# EasyEDA schematic SCH_RK86_power_2024-10-30.json
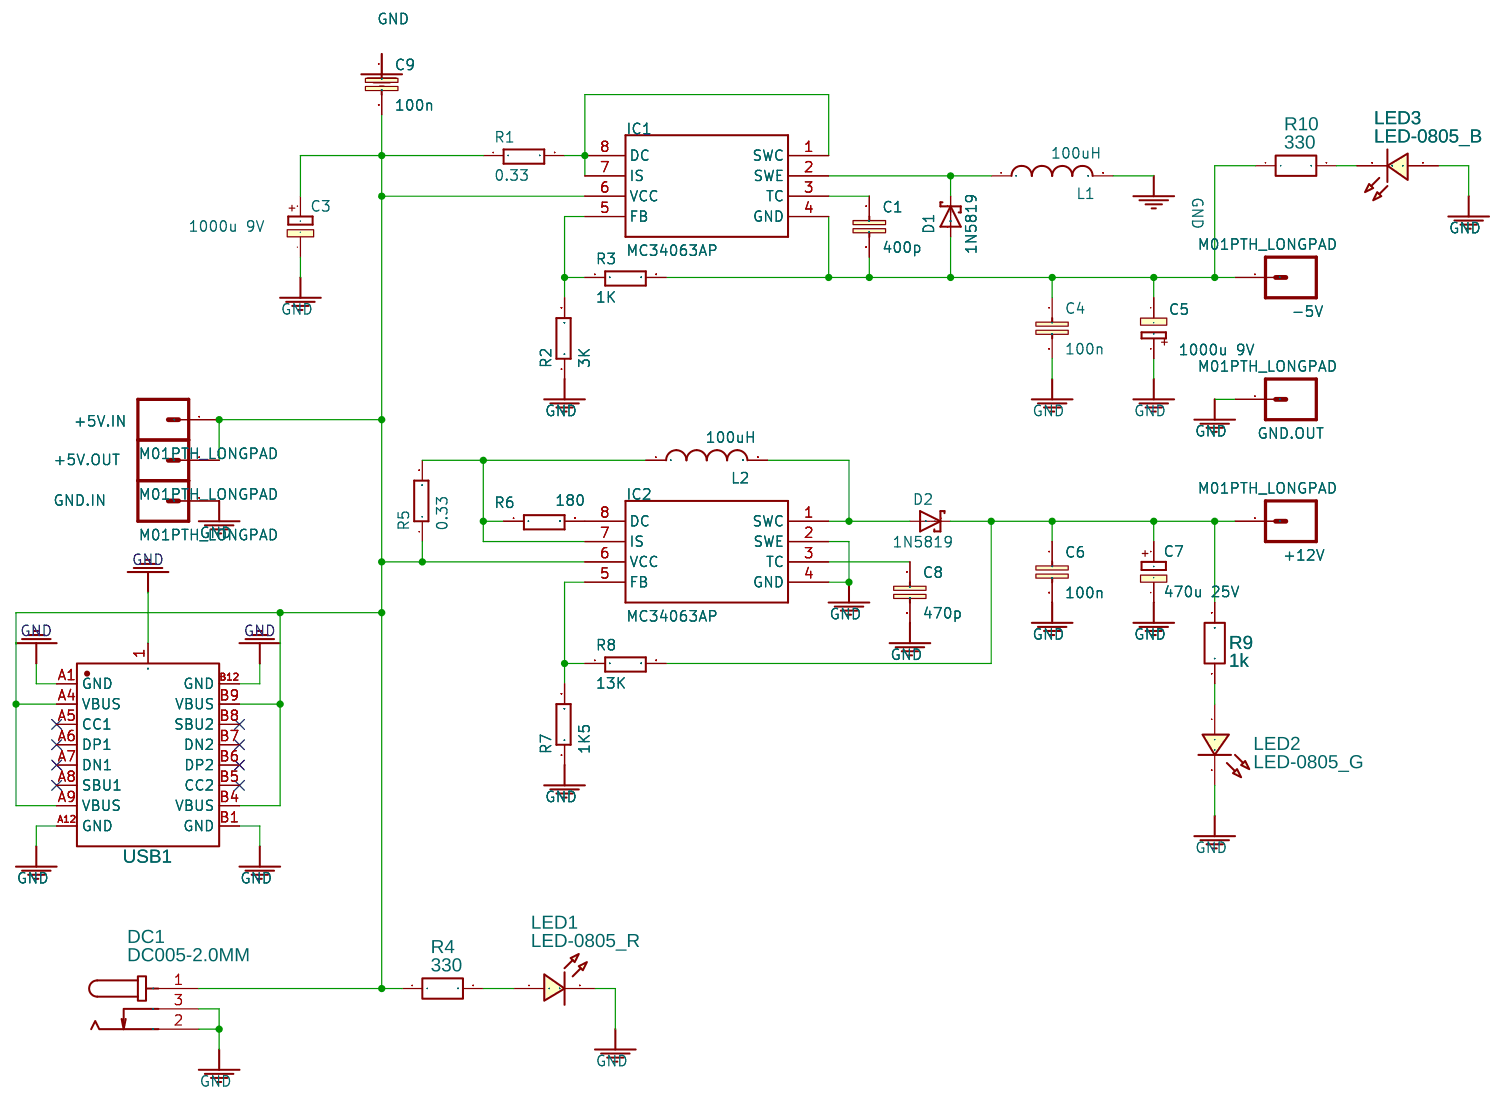
[diagram p0: schematic sheet]

## Parts
+5V.IN  M01PTH_LONGPAD  [1X01_LONGPAD]
+5V.OUT  M01PTH_LONGPAD  [1X01_LONGPAD]
+12V  M01PTH_LONGPAD  [1X01_LONGPAD]
-5V  M01PTH_LONGPAD  [1X01_LONGPAD]
C1  400p  [C1206]
C3  1000u 9V  [E3,5-8]
C4  100n  [C1206]
C5  1000u 9V  [E3,5-8]
C6  100n  [C1206]
C7  470u 25V  [E3,5-8]
C8  470p  [C1206]
C9  100n  [C1206]
D1  1N5819  [5819]
D2  1N5819  [5819]
DC1  DC005-2.0MM  [DC-IN-TH_DC005-T20]
GND.IN  M01PTH_LONGPAD  [1X01_LONGPAD]
GND.OUT  M01PTH_LONGPAD  [1X01_LONGPAD]
IC1  MC34063AP  [MC34063]
IC2  MC34063AP  [MC34063]
L1  100uH  [1270-100UH]
L2  100uH  [1270-100UH]
LED1  LED-0805_R  [LED0805_RED]
LED2  LED-0805_G  [LED0805_GREEN]
LED3  LED-0805_B  [LED0805_BLUE]
R1  0.33  [R0207]
R2  3K  [R0207]
R3  1K  [R0207]
R4  330  [R1206]
R5  0.33  [R0207]
R6  180  [R0207]
R7  1K5  [R0207]
R8  13K  [R0207]
R9  1k  [R1206]
R10  330  [R1206]
USB1  TYPE-C-2.0-16PIN-SMT-3  [TYPE-C-SMD_TYPE-CF3.1]

## Library data of the parts
DC1 = DC005-2.0MM: Supplier: LCSC; Manufacturer: SOFNG(硕方); Manufacturer Part: DC005-T20; Supplier Part: C111567; JLCPCB Part Class: Extended Part; link: https://lcsc.com/eda_search?q=C111567&%26type=1&ref=editor
LED1 = LED-0805_R: Manufacturer: EVERLIGHT(台湾亿光); Manufacturer Part: 17-21SURC/S530-A3/TR8; Supplier Part: C72037; Contributor: LCEDA_Lib
LED2 = LED-0805_G: Manufacturer: 国星光电; Manufacturer Part: NCD0805G1; Supplier Part: C84260; Contributor: LCEDA_Lib
LED3 = LED-0805_B: Manufacturer: 方舟 ARKLED; Manufacturer Part: D-B080508B1-KS2; Supplier Part: C108412; Contributor: LCEDA_Lib
R4 R9 = R_0805_EU: Contributor: LCEDA_Lib
R10 = R_1206_EU: Contributor: LCEDA_Lib
USB1 = TYPE-C-2.0-16PIN-SMT-3: Contributor: lcsc; Supplier: LCSC; Supplier Part: C2987386; Manufacturer: CIKI(皓富); JLCPCB Part Class: Extended Part

## Nets
GND: C3.- C4.2 C5.+ C6.2 C7.- C8.2 C9.1 DC1.2 DC1.3 GND.IN.1 GND.OUT.1 IC2.2(SWE) IC2.4(GND) L1.2 LED1.2 LED2.2 LED3.1 R2.1 R7.1 USB1.1(EH) USB1.A1(GND) USB1.A12(GND) USB1.B1(GND) USB1.B12(GND)
Net-(+5V.IN-1): +5V.IN.1 +5V.OUT.1 C3.+ C9.2 DC1.1 IC1.6(VCC) IC2.6(VCC) R1.1 R4.1 R5.1 USB1.A4(VBUS) USB1.A9(VBUS) USB1.B4(VBUS) USB1.B9(VBUS)
Net-(+12V-1): +12V.1 C6.1 C7.+ D2.2(C) R8.2 R9.2
Net-(-5V-1): -5V.1 C1.2 C4.1 C5.- D1.1(A) IC1.4(GND) R3.2 R10.1
Net-(C1-1): C1.1 IC1.3(TC)
Net-(C8-1): C8.1 IC2.3(TC)
Net-(D1-2): D1.2(C) IC1.2(SWE) L1.1
Net-(D2-1): D2.1(A) IC2.1(SWC) L2.2
Net-(IC1-1): IC1.1(SWC) IC1.7(IS) IC1.8(DC) R1.2
Net-(IC1-5): IC1.5(FB) R2.2 R3.1
Net-(IC2-5): IC2.5(FB) R7.2 R8.1
Net-(IC2-7): IC2.7(IS) L2.1 R5.2 R6.1
Net-(IC2-8): IC2.8(DC) R6.2
Net-(LED1-1): LED1.1 R4.2
Net-(LED2-1): LED2.1 R9.1
Net-(LED3-2): LED3.2 R10.2

Not connected (* = marked no-connect by the designer): USB1 A5(CC1)* A6(DP1)* A7(DN1)* A8(SBU1)* B5(CC2)* B6(DP2)* B7(DN2)* B8(SBU2)*
